# EAGLE schematic Frogduino (EAGLE 6.4)
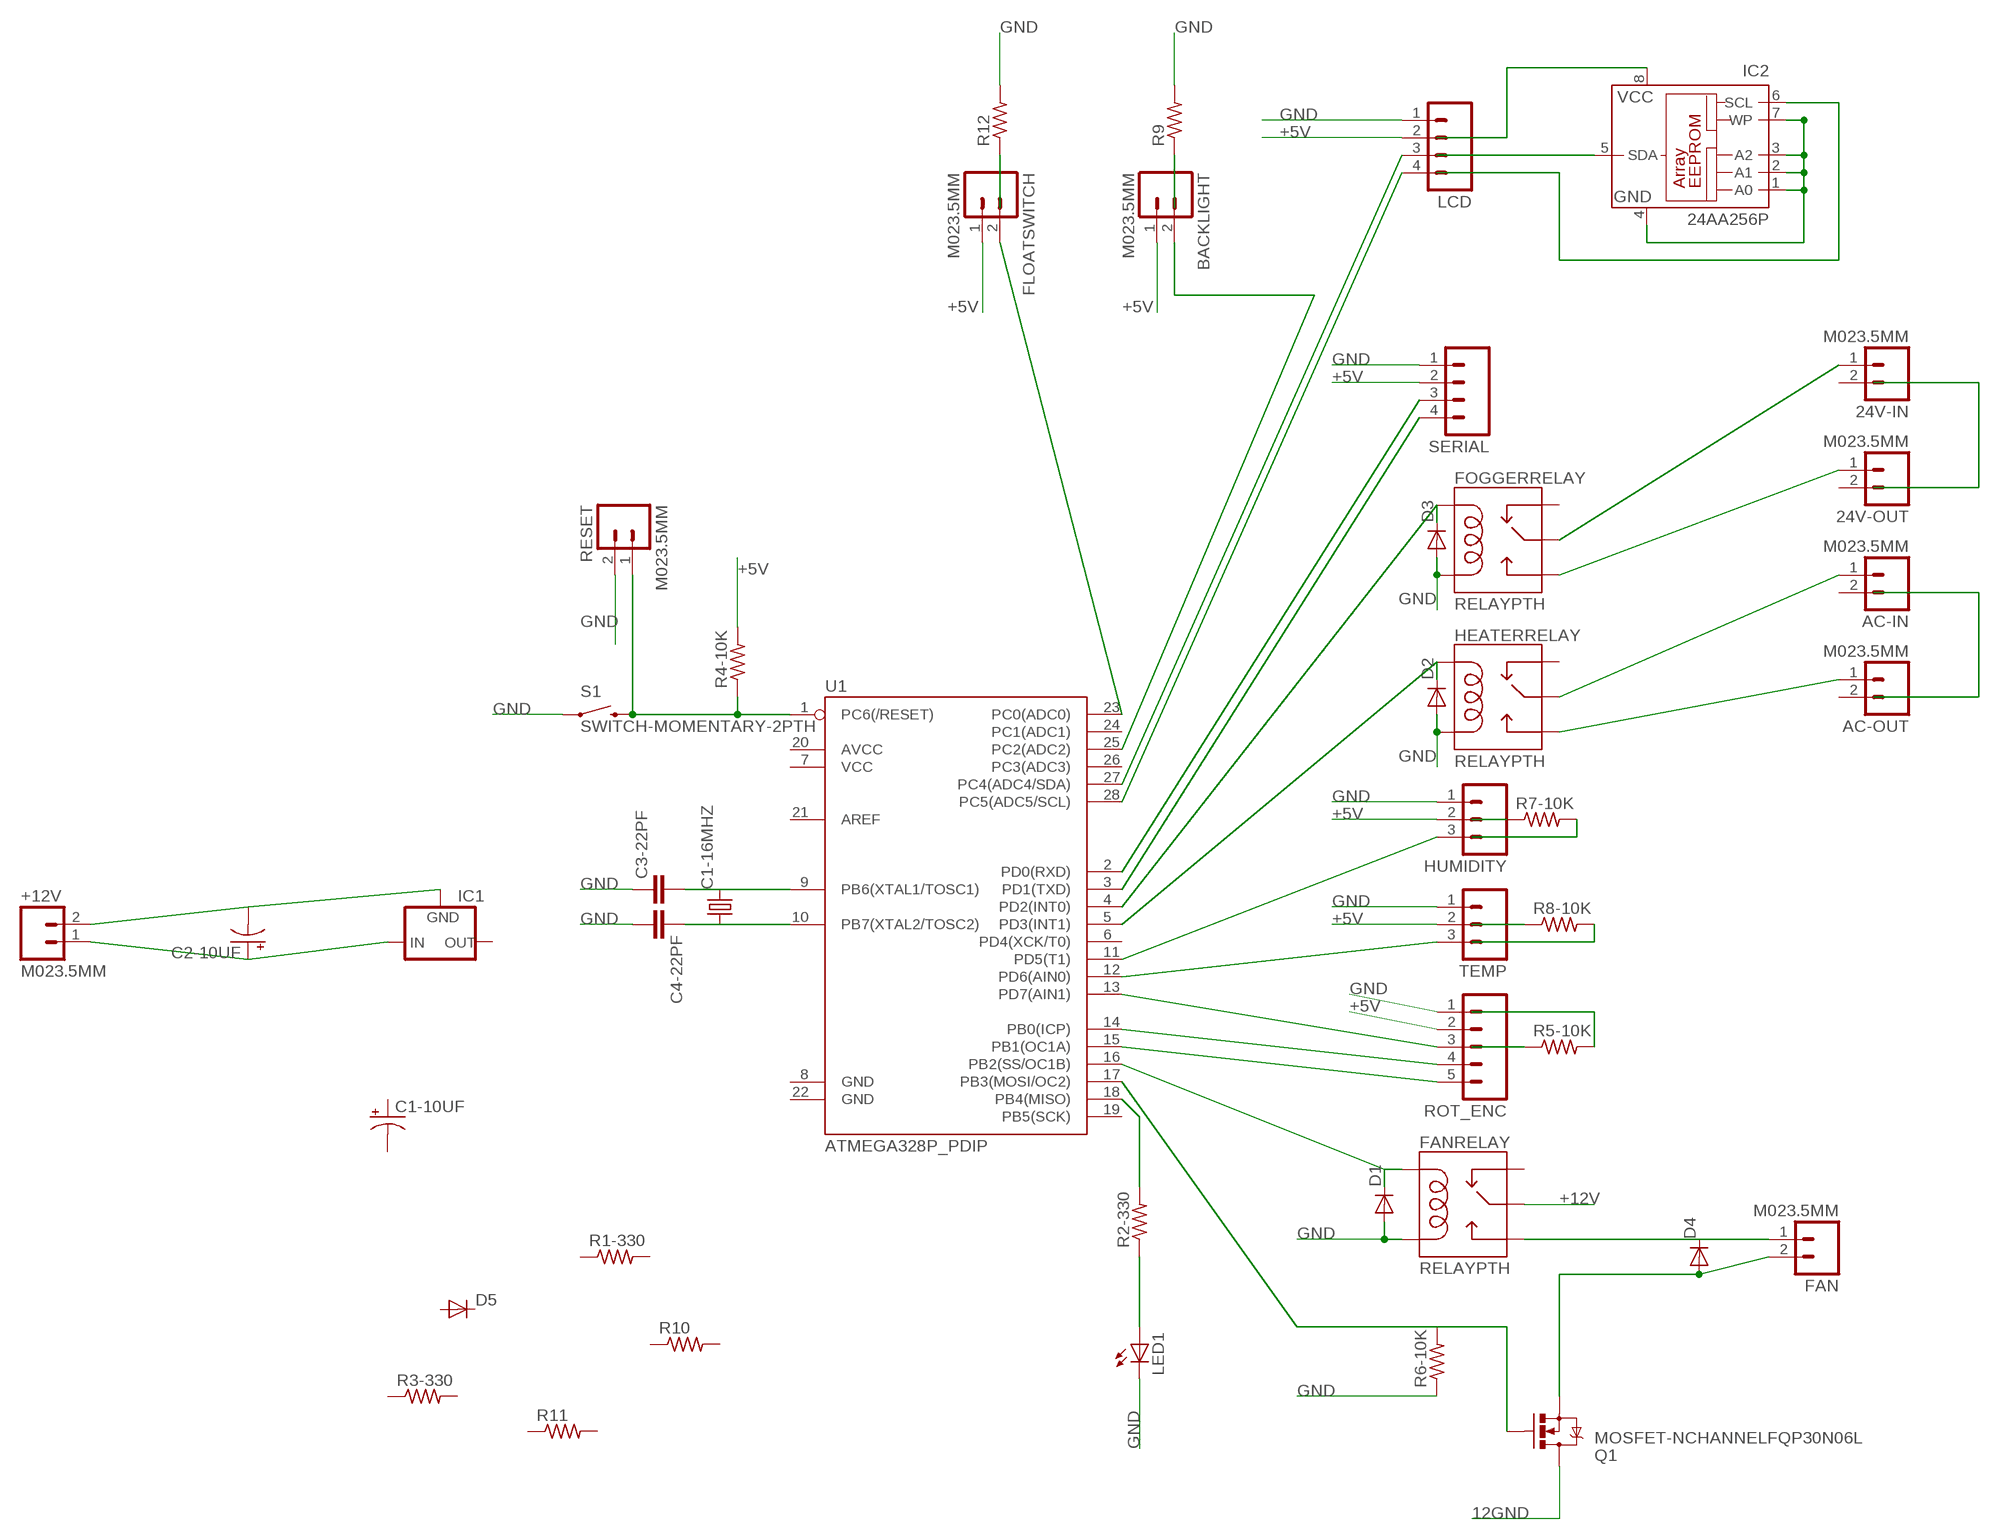
[diagram p0: schematic, sheet 1]

## Parts
24V-IN  M023.5MM  [SCREWTERMINAL-3.5MM-2]
24V-OUT  M023.5MM  [SCREWTERMINAL-3.5MM-2]
+12V  M023.5MM  [SCREWTERMINAL-3.5MM-2]
AC-IN  M023.5MM  [SCREWTERMINAL-3.5MM-2]
AC-OUT  M023.5MM  [SCREWTERMINAL-3.5MM-2]
BACKLIGHT  M023.5MM  [SCREWTERMINAL-3.5MM-2]
C1-10UF  CAP_POLPTH2  [CPOL-RADIAL-10UF-25V]
C1-16MHZ  CRYSTALHC49US  [HC49US]
C2-10UF  CAP_POLPTH2  [CPOL-RADIAL-10UF-25V]
C3-22PF  CAPKIT  [CAP-PTH-SMALL-KIT]
C4-22PF  CAPKIT  [CAP-PTH-SMALL-KIT]
D1  DIODEPTH  [DIODE-1N4001]
D2  DIODEPTH  [DIODE-1N4001]
D3  DIODEPTH  [DIODE-1N4001]
D4  DIODEPTH  [DIODE-1N4001]
D5  DIODEPTH  [DIODE-1N4001]
FAN  M023.5MM  [SCREWTERMINAL-3.5MM-2]
FANRELAY  RELAYPTH  [RELAY-G5Q]
FLOATSWITCH  M023.5MM  [SCREWTERMINAL-3.5MM-2]
FOGGERRELAY  RELAYPTH  [RELAY-G5Q]
HEATERRELAY  RELAYPTH  [RELAY-G5Q]
HUMIDITY  M03SCREW  [SCREWTERMINAL-3.5MM-3]
IC1  V_REG_78XX-TO-220  [TO-220-ALT]
IC2  24AA256P  [DIL8]
LCD  M04PTH  [1X04]
LED1  LED5MM  [LED5MM]
Q1  MOSFET-NCHANNELFQP30N06L  [TO220V]
R1-330  R-US_0204/5  [0204/5]
R2-330  R-US_0204/5  [0204/5]
R3-330  R-US_0204/5  [0204/5]
R4-10K  R-US_0204/5  [0204/5]
R5-10K  R-US_0204/5  [0204/5]
R6-10K  R-US_0204/5  [0204/5]
R7-10K  R-US_0204/5  [0204/5]
R8-10K  R-US_0204/5  [0204/5]
R9  R-US_0204/5  [0204/5]
R10  R-US_0204/5  [0204/5]
R11  R-US_0204/5  [0204/5]
R12  R-US_0204/5  [0204/5]
RESET  M023.5MM  [SCREWTERMINAL-3.5MM-2]
ROT_ENC  M05PTH  [1X05]
S1  SWITCH-MOMENTARY-2PTH  [TACTILE-PTH]
SERIAL  M04SCREW  [SCREWTERMINAL-3.5MM-4]
TEMP  M03SCREW  [SCREWTERMINAL-3.5MM-3]
U1  ATMEGA328P_PDIP  [DIL28-3]

## Nets
12GND: Q1.2(D)
+5V: BACKLIGHT.1 FLOATSWITCH.1 HUMIDITY.2 LCD.2 R4-10K.2 ROT_ENC.2 SERIAL.2 TEMP.2
+12V: D4.C FAN.1 FANRELAY.2(MAIN) FANRELAY.3(NO)
GND: C3-22PF.1 C4-22PF.2 D1.A D2.A D3.A FANRELAY.1(COIL2) FOGGERRELAY.1(COIL2) HEATERRELAY.1(COIL2) HUMIDITY.1 LCD.1 LED1.K(C) R6-10K.1 R9.2 R12.2 RESET.2 ROT_ENC.1 S1.1 SERIAL.1 TEMP.1
N$1: C1-16MHZ.2 C3-22PF.2 U1.9(PB6(XTAL1/TOSC1))
N$2: C1-16MHZ.1 C4-22PF.1 U1.10(PB7(XTAL2/TOSC2))
N$3: R4-10K.1 RESET.1 S1.3 U1.1(PC6(/RESET))
N$4: LCD.3 U1.27(PC4(ADC4/SDA))
N$5: LCD.4 U1.28(PC5(ADC5/SCL))
N$6: ROT_ENC.4 U1.14(PB0(ICP))
N$7: ROT_ENC.5 U1.15(PB1(OC1A))
N$8: ROT_ENC.3 U1.13(PD7(AIN1))
N$9: R5-10K.1
N$10: R5-10K.2
N$11: +12V.1 C2-10UF.1(+) IC1.IN
N$12: D1.C FANRELAY.5(COIL1) U1.16(PB2(SS/OC1B))
N$13: D4.A FAN.2 Q1.3(S)
N$14: Q1.1(G) R6-10K.2 U1.17(PB3(MOSI/OC2))
N$15: TEMP.3 U1.12(PD6(AIN0))
N$16: HUMIDITY.3 U1.11(PD5(T1))
N$17: R7-10K.1
N$18: R7-10K.2
N$19: R8-10K.2
N$20: R8-10K.1
N$21: R2-330.2 U1.18(PB4(MISO))
N$22: LED1.A R2-330.1
N$24: D3.C FOGGERRELAY.5(COIL1) U1.4(PD2(INT0))
N$25: 24V-IN.1 FOGGERRELAY.2(MAIN)
N$26: D2.C HEATERRELAY.5(COIL1) U1.5(PD3(INT1))
N$27: 24V-OUT.1 FOGGERRELAY.3(NO)
N$29: SERIAL.4 U1.3(PD1(TXD))
N$30: AC-IN.1 HEATERRELAY.2(MAIN)
N$31: AC-OUT.1 HEATERRELAY.3(NO)
N$32: SERIAL.3 U1.2(PD0(RXD))
N$33: BACKLIGHT.2 U1.25(PC2(ADC2))
N$34: FLOATSWITCH.2 U1.23(PC0(ADC0))
N$35: +12V.2 C2-10UF.2(-) IC1.GND
N$36: IC2.5(SDA)
N$37: R12.1
N$38: R9.1
N$39: IC2.8(VCC)
N$40: IC2.1(A0) IC2.2(A1) IC2.3(A2) IC2.4(GND) IC2.7(WP)
N$41: IC2.6(SCL)
Unconnected: 24V-IN.2 24V-OUT.2 AC-IN.2 AC-OUT.2 C1-10UF.1(+) C1-10UF.2(-) D5.A D5.C FANRELAY.4(NC) FOGGERRELAY.4(NC) HEATERRELAY.4(NC) IC1.OUT R1-330.1 R1-330.2 R3-330.1 R3-330.2 R10.1 R10.2 R11.1 R11.2 U1.6(PD4(XCK/T0)) U1.7(VCC) U1.8(GND) U1.19(PB5(SCK)) U1.20(AVCC) U1.21(AREF) U1.22(GND) U1.24(PC1(ADC1)) U1.26(PC3(ADC3))

## Library data of the parts
24V-IN 24V-OUT +12V AC-IN AC-OUT BACKLIGHT FAN FLOATSWITCH RESET = SparkFun-Connectors:M02: Standard 2-pin 0.1" header. Use with - straight break away headers ( PRT-00116) - right angle break away headers (PRT-00553) - swiss pins (PRT-00743) - machine pins (PRT-00117) - female headers (PRT-00115) Molex polarized connector foot print use with: PRT-08233 with associated crimp pins and housings. 2.54_SCREWTERM for use with PRT-10571. 3.5mm Screw Terminal footprints for PRT-08084 5mm Screw Terminal footprints for use with PRT-08433
C1-10UF C2-10UF = SparkFun-Capacitors:CAP_POL: Capacitor Polarized These are standard SMD and PTH capacitors. Normally 10uF, 47uF, and 100uF in electrolytic and tantalum varieties. Always verify the external diameter of the through hole cap, it varies with capacity, voltage, and manufacturer. The EIA devices should be standard.
C1-16MHZ = SparkFun-FreqCtrl:CRYSTAL: Various standard crystals. Proven footprints. Spark Fun Electronics SKU : COM-00534
C3-22PF C4-22PF = SparkFun-Capacitors:CAP: Capacitor Standard 0603 ceramic capacitor, and 0.1" leaded capacitor.
D1-D5 = SparkFun-DiscreteSemi:DIODE: Diode These are standard reverse protection diodes and small signal diodes. SMA package can handle up to about 1A. SOD-323 can handle about 200mA. What the SOD-323 package when ordering, there are some mfgs out there that are 5-pin packages.
FANRELAY FOGGERRELAY HEATERRELAY = SparkFun-Electromechanical:RELAY: SPDT relay (COM-00101)
HUMIDITY TEMP = SparkFun-Connectors:M03: Header 3 Standard 3-pin 0.1" header. Use with straight break away headers (SKU : PRT-00116), right angle break away headers (PRT-00553), swiss pins (PRT-00743), machine pins (PRT-00117), and female headers (PRT-00115). Molex polarized connector foot print use with SKU : PRT-08232 with associated crimp pins and housings.
IC1 = SparkFun-PowerIC:V_REG_78XX: Voltage Regulator Standard 7805 5V regulator. IGO (Input Ground Output). Spark Fun Electronics SKU : COM-00107
IC2 = microchip:24*: Serial EEPROM I2C; MF: MICROCHIP; MPN: 24AA256-I/P; OC_FARNELL: 1331294; OC_NEWARK: 92C6872
LCD SERIAL = SparkFun-Connectors:M04: Header 4 Standard 4-pin 0.1" header. Use with straight break away headers (SKU : PRT-00116), right angle break away headers (PRT-00553), swiss pins (PRT-00743), machine pins (PRT-00117), and female headers (PRT-00115). Molex polarized connector foot print use with SKU : PRT-08231 with associated crimp pins and housings. 1MM SMD Version SKU: PRT-10208
LED1 = SparkFun-LED:LED: LEDs Standard schematic elements and footprints for 5mm, 3mm, 1206, and 0603 sized LEDs. 5mm - Spark Fun Electronics SKU : COM-00529 (and others)
Q1 = SparkFun-DiscreteSemi:MOSFET-NCHANNEL: Common NMOSFET Parts MFG P/N Store ID Prod ID FDD8780 TRANS-09984 SI7820DN TRANS-11055 FDS6630A IC-08089 2N7002PW TRANS-11151 FQP30N06L COM-10213 TRANS-10060 BSS123LT1G TRANS-08345 BSS138 TRANS-00830 BS170 2N7000; PROD_ID: TRANS-10060
R1-330 R2-330 R3-330 R4-10K R5-10K R6-10K R7-10K R8-10K R9-R12 = resistor:R-US_: RESISTOR, American symbol
ROT_ENC = SparkFun-Connectors:M05: Header 5 Standard 5-pin 0.1" header. Use with straight break away headers (SKU : PRT-00116), right angle break away headers (PRT-00553), swiss pins (PRT-00743), machine pins (PRT-00117), and female headers (PRT-00115). Molex polarized connector foot print use with SKU : PRT-08230 with associated crimp pins and housings.
S1 = SparkFun-Electromechanical:SWITCH-MOMENTARY-2: Various NO switches- pushbuttons, reed, etc
U1 = SparkFun-DigitalIC:ATMEGA328P_PDIP: uC used in the Arduino 32kb flash, 1k EEPROM, 2k SRAM This is the through-hole version of this chip.